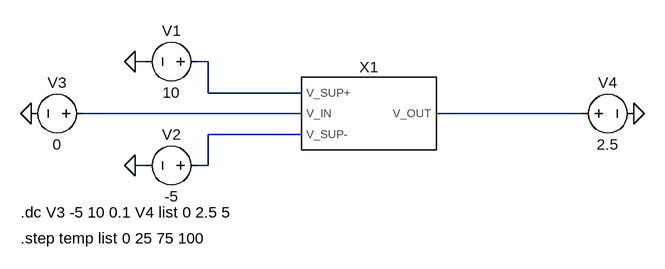
[diagram p0: schematic sim_power-electronics.asc]
sim_power-electronics.asc, the LTspice schematic file:
Version 4
SHEET 1 880 680
WIRE -64 80 -80 80
WIRE 32 80 16 80
WIRE 32 128 32 80
WIRE 176 128 32 128
WIRE 176 160 -160 160
WIRE 608 160 384 160
WIRE 176 192 32 192
WIRE -64 240 -80 240
WIRE 32 240 32 192
WIRE 32 240 16 240
FLAG -80 240 0
FLAG -80 80 0
FLAG -240 160 0
FLAG 688 160 0
SYMBOL voltage 32 80 R90
WINDOW 0 -32 56 VBottom 2
WINDOW 3 32 56 VTop 2
WINDOW 123 0 0 Left 0
WINDOW 39 0 0 Left 0
SYMATTR InstName V1
SYMATTR Value 10
SYMBOL voltage 32 240 R90
WINDOW 0 -32 56 VBottom 2
WINDOW 3 32 56 VTop 2
WINDOW 123 0 0 Left 0
WINDOW 39 0 0 Left 0
SYMATTR InstName V2
SYMATTR Value -5
SYMBOL voltage -144 160 R90
WINDOW 0 -32 56 VBottom 2
WINDOW 3 32 56 VTop 2
WINDOW 123 0 0 Left 0
WINDOW 39 0 0 Left 0
SYMATTR InstName V3
SYMATTR Value 0
SYMBOL voltage 592 160 R270
WINDOW 0 32 56 VTop 2
WINDOW 3 -32 56 VBottom 2
WINDOW 123 0 0 Left 0
WINDOW 39 0 0 Left 0
SYMATTR InstName V4
SYMATTR Value 2.5
SYMBOL power-electronics 272 160 R0
SYMATTR InstName X1
TEXT -256 312 Left 2 !.dc V3 -5 10 0.1 V4 list 0 2.5 5
TEXT -256 352 Left 2 !.step temp list 0 25 75 100

The netlist it stands for:
* sim_power-electronics.asc
V1 N001 0 10
V2 N004 0 -5
V3 N002 0 0
V4 N003 0 2.5
XX1 N002 N001 N004 N003 power-electronics  ; pins V_IN V_SUP+ V_SUP- V_OUT
.dc V3 -5 10 0.1 V4 list 0 2.5 5
.step temp list 0 25 75 100
.backanno
.end